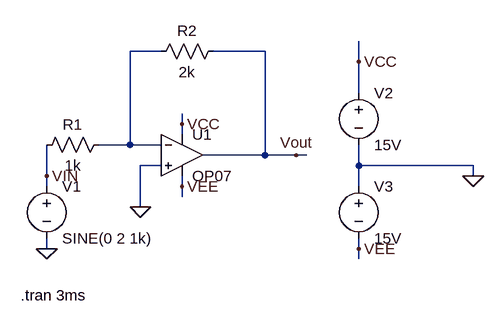
[diagram p0: schematic inverting__ltspice.asc]
inverting__ltspice.asc, the LTspice schematic file:
Version 4
SHEET 1 880 680
WIRE 192 0 144 0
WIRE 352 0 272 0
WIRE 496 16 496 -16
WIRE 496 64 496 16
WIRE 224 112 224 96
WIRE 224 128 224 112
WIRE 144 144 144 0
WIRE 144 144 96 144
WIRE 192 144 144 144
WIRE 352 160 352 0
WIRE 352 160 256 160
WIRE 400 160 352 160
WIRE 416 160 400 160
WIRE 192 176 160 176
WIRE 496 176 496 144
WIRE 672 176 496 176
WIRE 16 192 16 144
WIRE 672 192 672 176
WIRE 16 208 16 192
WIRE 224 208 224 192
WIRE 496 208 496 176
WIRE 224 224 224 208
WIRE 160 240 160 176
WIRE 16 304 16 288
WIRE 496 304 496 288
WIRE 496 320 496 304
FLAG 16 304 0
FLAG 160 240 0
FLAG 16 192 VIN
FLAG 400 160 Vout
FLAG 224 208 VEE
FLAG 496 304 VEE
FLAG 672 192 0
FLAG 224 112 VCC
FLAG 496 16 VCC
SYMBOL OpAmps\\OP07 224 96 R0
SYMATTR InstName U1
SYMBOL res 288 -16 R90
WINDOW 0 0 56 VBottom 2
WINDOW 3 32 56 VTop 2
SYMATTR InstName R2
SYMATTR Value 2k
SYMBOL res 112 128 R90
WINDOW 0 0 56 VBottom 2
WINDOW 3 32 56 VTop 2
SYMATTR InstName R1
SYMATTR Value 1k
SYMBOL voltage 16 192 R0
WINDOW 123 0 0 Left 0
WINDOW 39 0 0 Left 0
SYMATTR InstName V1
SYMATTR Value SINE(0 2 1k)
SYMBOL voltage 496 48 R0
SYMATTR InstName V2
SYMATTR Value 15V
SYMBOL voltage 496 192 R0
SYMATTR InstName V3
SYMATTR Value 15V
TEXT -24 376 Left 2 !.tran 3ms

The netlist it stands for:
* inverting__ltspice.asc
XU1 0 N001 VCC VEE Vout LT1001  ; OP07, pins In+ In- V+ V- OUT
R2 Vout N001 2k
R1 N001 VIN 1k
V1 VIN 0 SINE(0 2 1k)
V2 VCC 0 15V
V3 0 VEE 15V
.tran 3ms
.lib LTC.lib
.backanno
.end